# Altium project Morpheus_pill_bqle.PrjPcb
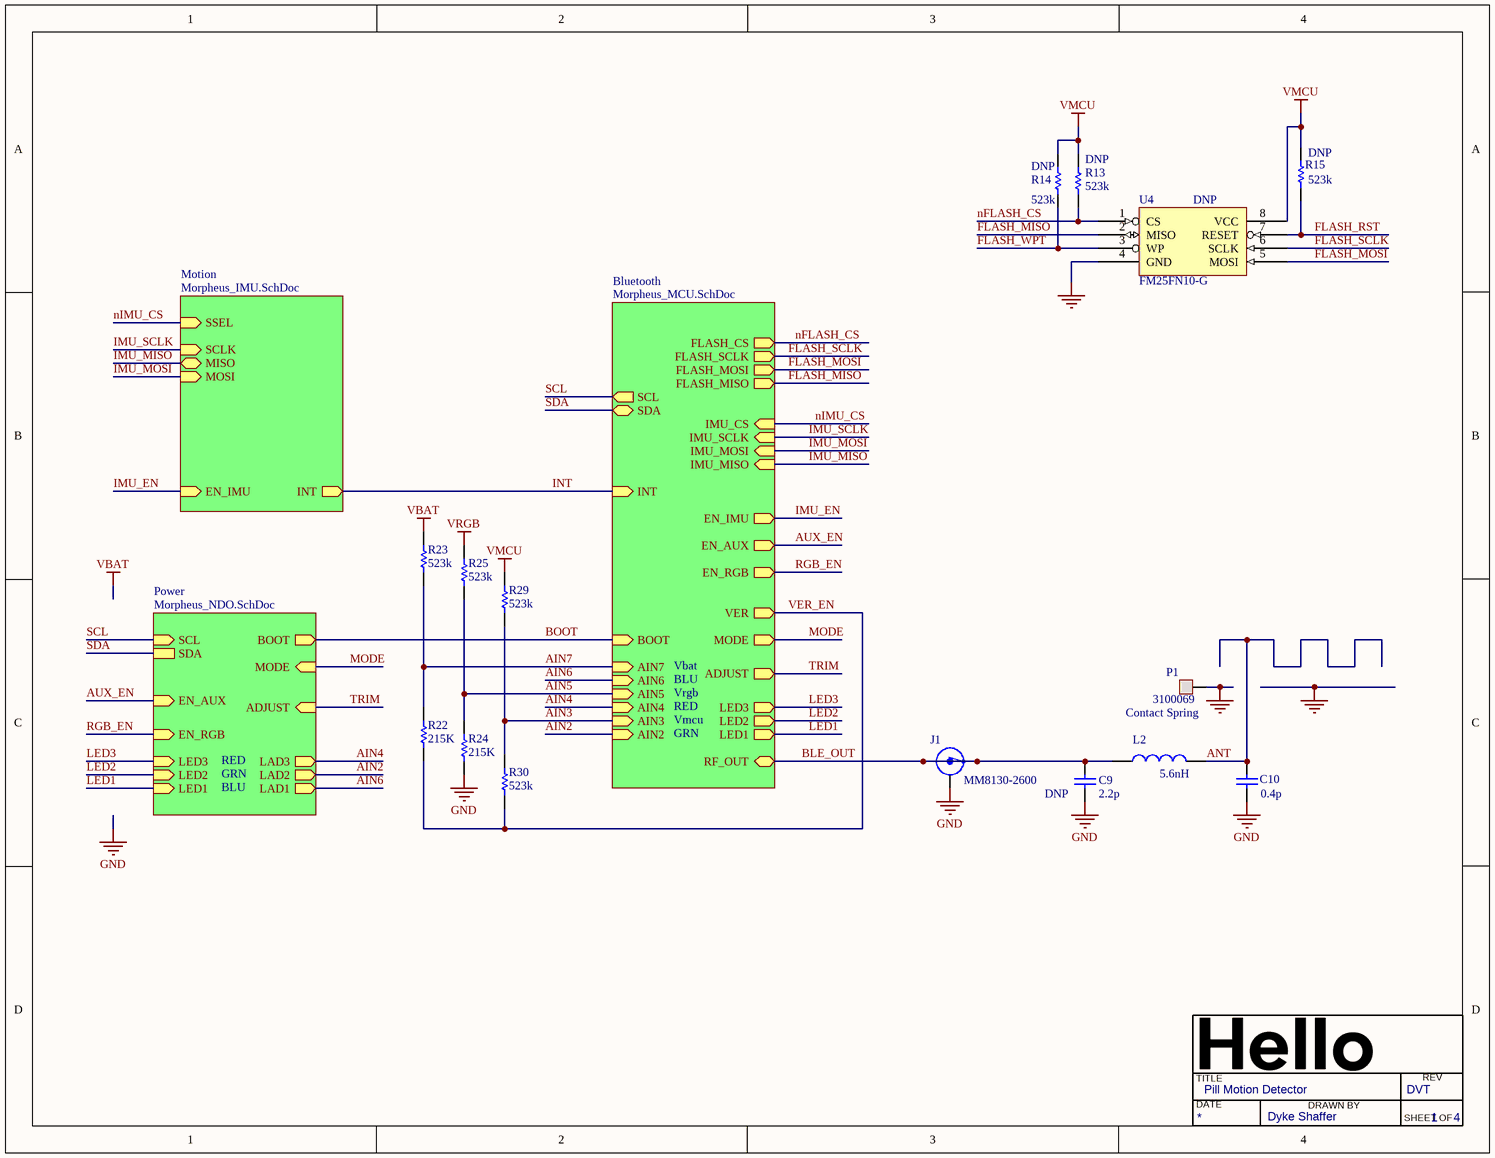
[diagram p0: Morpheus_pill_bqle.SchDoc]
4 sheets, 116 parts. Net scope: hierarchical (ports join the sheet entries above them; power ports are global).
Board files: Morpheus_pill_bqle.PcbDoc, morpheus_pill_bqle_ASSY.PcbDoc
Sheets:
  Morpheus_pill_bqle.SchDoc
    Bluetooth = Morpheus_MCU.SchDoc
    Motion = Morpheus_IMU.SchDoc
    Power = Morpheus_NDO.SchDoc

## Sheet Morpheus_pill_bqle.SchDoc: Pill Motion Detector
size Letter; DrawnBy: Dyke Shaffer; Organization: Hello Inc.; Revision: DVT; SheetNumber: 1; SheetTotal: 4

### Parts
C9  DNP  value 2.2p  [CAP0402_SENSE_DVT]
C10  value 0.4p  [CAP0402_SENSE_DVT]
J1  MM8130-2600  [COAXIAL-SWF]
L2  value 5.6nH  [IND_0402]
P1  Contact Spring  PN: 3100069  [TP120X70SC]
R13  DNP  value 523k  [RES0402_SENSE_DVT]
R14  DNP  value 523k  [RES0402_SENSE_DVT]
R15  DNP  value 523k  [RES0402_SENSE_DVT]
R22  215K  [RES0402_SENSE_DVT]
R23  523k  [RES0402_SENSE_DVT]
R24  215K  [RES0402_SENSE_DVT]
R25  523k  [RES0402_SENSE_DVT]
R29  523k  [RES0402_SENSE_DVT]
R30  523k  [RES0402_SENSE_DVT]
U4  DNP  PN: FM25FN10-G  [DFN127P600x500x80-8E]

### Sub-sheets
Bluetooth = Morpheus_MCU.SchDoc: FLASH_SCLK (out), FLASH_CS (out), INT (in), LED3 (out), EN_IMU (out), AIN6 (in), BOOT (in), SCL (out), SDA, AIN7 (in), EN_AUX (out), AIN4 (in), AIN5 (in), AIN2 (in), AIN3 (in), RF_OUT, ADJUST (out), LED2 (out), LED1 (out), EN_RGB (out), VER (out), IMU_MISO (in), IMU_SCLK (in), IMU_MOSI (in), IMU_CS (in), FLASH_MOSI (out), FLASH_MISO (out), MODE (out)
Motion = Morpheus_IMU.SchDoc: MOSI (in), MISO, SCLK (in), INT (out), SSEL (in), EN_IMU (in)
Power = Morpheus_NDO.SchDoc: SDA, BOOT (out), SCL (in), LAD3 (out), LAD2 (out), LAD1 (out), EN_AUX (in), EN_RGB (in), ADJUST (in), LED3 (in), LED2 (in), LED1 (in), MODE (in)

### Nets
GND: C9.2 C10.2 J1.2(Shield) P1.1 R24.1 U4.4(GND)
VBAT: R23.2
VMCU: R13.2 R14.2 R15.2 R29.2 U4.8(VCC)
VRGB: R25.2
AIN2: sheet Bluetooth/AIN2, sheet Power/LAD2
AIN3: R29.1 R30.2 ; sheet Bluetooth/AIN3
AIN4: sheet Bluetooth/AIN4, sheet Power/LAD3
AIN5: R24.2 R25.1 ; sheet Bluetooth/AIN5
AIN6: sheet Bluetooth/AIN6, sheet Power/LAD1
AIN7: R22.2 R23.1 ; sheet Bluetooth/AIN7
ANT: C10.1 L2.2
AUX_EN: sheet Bluetooth/EN_AUX, sheet Power/EN_AUX
BLE_OUT: C9.1 J1.1(IN) J1.3(OUT) L2.1 ; sheet Bluetooth/RF_OUT
BOOT: sheet Bluetooth/BOOT, sheet Power/BOOT
FLASH_MISO: U4.2(MISO) ; sheet Bluetooth/FLASH_MISO
FLASH_MOSI: U4.5(MOSI) ; sheet Bluetooth/FLASH_MOSI
FLASH_RST: R15.1 U4.7(RESET)
FLASH_SCLK: U4.6(SCLK) ; sheet Bluetooth/FLASH_SCLK
FLASH_WPT: R14.1 U4.3(WP)
IMU_EN: sheet Bluetooth/EN_IMU, sheet Motion/EN_IMU
IMU_MISO: sheet Bluetooth/IMU_MISO, sheet Motion/MISO
IMU_MOSI: sheet Bluetooth/IMU_MOSI, sheet Motion/MOSI
IMU_SCLK: sheet Bluetooth/IMU_SCLK, sheet Motion/SCLK
INT: sheet Bluetooth/INT, sheet Motion/INT
LED1: sheet Bluetooth/LED1, sheet Power/LED1
LED2: sheet Bluetooth/LED2, sheet Power/LED2
LED3: sheet Bluetooth/LED3, sheet Power/LED3
MODE: sheet Bluetooth/MODE, sheet Power/MODE
nFLASH_CS: R13.1 U4.1(CS) ; sheet Bluetooth/FLASH_CS
nIMU_CS: sheet Bluetooth/IMU_CS, sheet Motion/SSEL
RGB_EN: sheet Bluetooth/EN_RGB, sheet Power/EN_RGB
SCL: sheet Bluetooth/SCL, sheet Power/SCL
SDA: sheet Bluetooth/SDA, sheet Power/SDA
TRIM: sheet Bluetooth/ADJUST, sheet Power/ADJUST
VER_EN: R22.1 R30.1 ; sheet Bluetooth/VER

### Notes on the sheet
- BLU
- Vbat
- Vrgb
- GRN
- RED
- Vmcu
- TITLE
- DATE
- DRAWN BY
- REV
- SHEET
- OF

### Library data of the parts
C9 = C_2.2p_5_50_NPO_0402: Chip capacitor; Vendor: Murata; PN: GRM1555C1H2R20BA01D; Tolerance: 5 %; Voltage: 50 V; Temp: NPO; Size: 0402
C10 = C_0.4p_5_50_NPO_0402: Chip capacitor; Vendor: Murata; PN: GRM1555C1Hr40BA01D; Tolerance: 5 %; Voltage: 50 V; Temp: NPO; Size: 0402
J1 = MM8130-2600: Coaxial Connector with Switch; Manufacturer: Murata; 2nd source part number: 81-MM8130-2600RA2; Artikkelnr Noca: 55029011; Artikkelnr Simpro: N.A.; Part Number: MM8130-2600; Manufacturer Part Number: MM8130-2600; Datasheet: http://www.murata.com/products/catalog/pdf/o33e.pdf; LatestRevisionDate: 2014-04-24; Pin Count: 3; Publisher: Nordic Semiconductor; Published: 2014-04-24; Value: MM8130-2600; Note: *; Supplier: Digi-Key; Supplier part number: 490-4981-1-ND; 2nd source Supplier: Mouser; Footprint Doc: COAXIAL-SWF
L2 = L_5.6n_0.1_?_270_300_?: SMD RF inductor 2.2nH; PN: L-07C5N6SV6T; Vendor: Johanson; Tolerance: 0.1; RDC: 270; I_max: 300mA; Q: ?; I_sat: ?
P1 = TP-120X70-SC: Test Pad 120x70 mil ( contact spring ); Vendor: TE Connectivity
R13-R15 R23 R25 R29 R30 = R_523k_1_0.1_0402: Chip Resistor; Vendor: Panasonic; Tolerance: 1 %; Power: 0.1 W; PN: ERJ-2RKF5233X; Model: *; Size: 0402
  R23 R25 R29 R30: Value: 523k
R22 R24 = R_215K_1_0.1_0402: Chip Resistor; Vendor: Panasonic; Tolerance: 1 %; Power: 0.1 W; PN: ERJ-2RKF2153X; Model: *; Value: 215K; Size: 0402
U4 = FM25VN10-G: Cypress SPI FRAM 128Kx8; Vendor: Fujitsu; Value: FRAM

## Sheet Morpheus_MCU.SchDoc: Bluetooth Low Energy MCU
size Letter; Author: Dyke Shaffer; CompanyName: Hello, Inc.; Engineer: Dyke Shaffer; Organization: Hello, Inc.; Revision: DVT; SheetNumber: 4; SheetTotal: 4
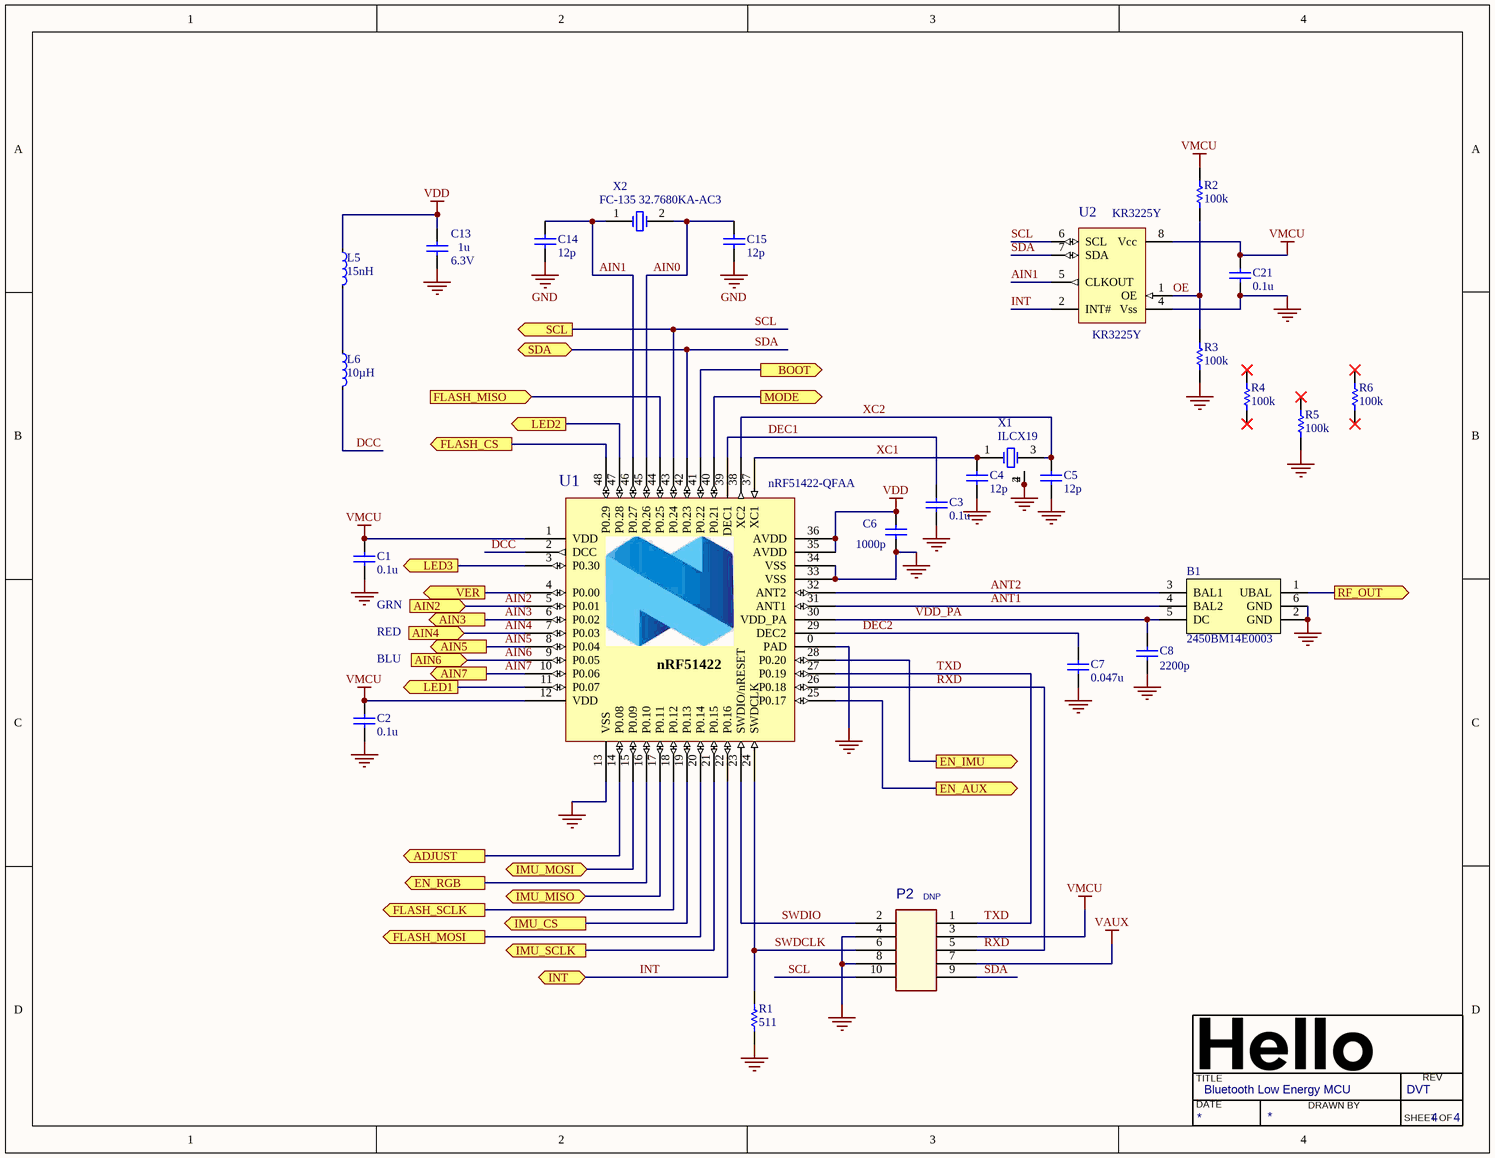
[diagram p1: Morpheus_MCU.SchDoc]

### Parts
B1  2450BM14E0003  [DFN50P160X80X70-6N]
C1  0.1u  [CAP0402_SENSE_DVT]
C2  0.1u  [CAP0402_SENSE_DVT]
C3  0.1u  [CAP0402_SENSE_DVT]
C4  12p  [CAP0402_SENSE_DVT]
C5  12p  [CAP0402_SENSE_DVT]
C6  1000p  [CAP0402_SENSE_DVT]
C7  value 0.047u  [CAP0402_SENSE_DVT]  (hidden comment: C_0.047u_10_16_X5R_0201)
C8  2200p  [CAP0402_SENSE_DVT]
C13  1u  Voltage: 6.3V  [CAP0402_SENSE_DVT]
C14  12p  [CAP0402_SENSE_DVT]
C15  12p  [CAP0402_SENSE_DVT]
C21  0.1u  [CAP0402_SENSE_DVT]
L5  15nH  [INDC1005X04L]
L6  10µH  [INDC1608X06L]
P2  DNP  [HDR1.27-2X5-N]
R1  511  [RES0402_SENSE_DVT]
R2  100k  [RES0402_SENSE_DVT]
R3  100k  [RES0402_SENSE_DVT]
R4  100k  [RES0402_SENSE_DVT]
R5  100k  [RES0402_SENSE_DVT]
R6  100k  [RES0402_SENSE_DVT]
U1  nRF51422-QFAA  [VQFN40P600X600X100-48]
U2  KR3225Y  [8-CLCC-KYOCERO]
X1  ILCX19  [ILCX19]
X2  FC-135 32.7680KA-AC3  [Epson_FC-135]

### Ports
ADJUST (out), AIN2 (in), AIN3 (out), AIN4 (in), AIN5 (out), AIN6 (in), AIN7 (out), BOOT (out), EN_AUX (out), EN_IMU (out), EN_RGB (out), FLASH_CS (out), FLASH_MISO (in), FLASH_MOSI (out), FLASH_SCLK (out), IMU_CS (out), IMU_MISO, IMU_MOSI, IMU_SCLK (out), INT (bidir), LED1 (out), LED2 (out), LED3 (out), MODE (out), RF_OUT (out), SCL (out), SDA, VER (out)

### Nets
GND: B1.2(GND) B1.6(GND) C1.1 C2.1 C3.1 C4.1 C5.1 C6.1 C7.1 C8.1 C13.1 C14.1 C15.1 C21.1 P2.4 P2.8 R1.1 R3.1 R5.1 U1.0(PAD) U1.13(VSS) U1.33(VSS) U1.34(VSS) U2.4(NC) X1.2(GND1) X1.4(XTAL2)
VAUX: P2.7
VDD: C6.2 C13.2 L5.1 U1.35(AVDD) U1.36(AVDD)
VMCU: C1.2 C2.2 C21.2 P2.3 R2.2 U1.1(VDD) U1.12(VDD) U2.8(Vcc)
AIN0: C15.2 U1.45(P0.26) X2.2
AIN1: C14.2 U1.46(P0.27) U2.5(CLKOUT) X2.1
AIN2: U1.5(P0.01) ; port AIN2
AIN3: U1.6(P0.02) ; port AIN3
AIN4: U1.7(P0.03) ; port AIN4
AIN5: U1.8(P0.04) ; port AIN5
AIN6: U1.9(P0.05) ; port AIN6
AIN7: U1.10(P0.06) ; port AIN7
ANT1: B1.4(BAL2) U1.31(ANT1)
ANT2: B1.3(BAL1) U1.32(ANT2)
AUX_EN: U1.25(P0.17) ; port EN_AUX
BLE_OUT: B1.1(UBAL) ; port RF_OUT
BOOT: U1.41(P0.22) ; port BOOT
DCC: L6.2 U1.2(DCC)
DEC1: C3.2 U1.39(DEC1)
DEC2: C7.2 U1.29(DEC2)
FLASH_MISO: U1.44(P0.25) ; port FLASH_MISO
FLASH_MOSI: U1.20(P0.14) ; port FLASH_MOSI
FLASH_SCLK: U1.18(P0.12) ; port FLASH_SCLK
IMU_EN: U1.28(P0.20) ; port EN_IMU
IMU_MISO: U1.17(P0.11) ; port IMU_MISO
IMU_MOSI: U1.15(P0.09) ; port IMU_MOSI
IMU_SCLK: U1.21(P0.15) ; port IMU_SCLK
INT: U1.22(P0.16) U2.2(INT#) ; port INT
LED1: U1.11(P0.07) ; port LED1
LED2: U1.47(P0.28) ; port LED2
LED3: U1.3(P0.30) ; port LED3
MODE: U1.40(P0.21) ; port MODE
nFLASH_CS: U1.48(P0.29) ; port FLASH_CS
nIMU_CS: U1.19(P0.13) ; port IMU_CS
OE: R2.1 R3.2 U2.1(OE)
RGB_EN: U1.16(P0.10) ; port EN_RGB
RXD: P2.5 U1.26(P0.18)
SCL: P2.10 U1.43(P0.24) U2.6(SCL) ; port SCL
SDA: P2.9 U1.42(P0.23) U2.7(NC) ; port SDA
SWDCLK: P2.6 R1.2 U1.24(SWDCLK)
SWDIO: P2.2 U1.23(SWDIO/nRESET)
TRIM: U1.14(P0.08) ; port ADJUST
TXD: P2.1 U1.27(P0.19)
VDD_PA: B1.5(DC) C8.2 U1.30(VDD_PA)
VER_EN: U1.4(P0.00) ; port VER
XC1: C4.2 U1.37(XC1) X1.1(XTAL1)
XC2: C5.2 U1.38(XC2) X1.3(XTAL2)
NetL5_2: L5.2 L6.1

Not connected (* = marked no-connect by the designer): R4 1* 2*; R5 2*; R6 1* 2*

### Notes on the sheet
- (near C1) GRN
- RED
- (near C2) BLU
- TITLE
- DATE
- DRAWN BY
- REV
- SHEET
- OF
- (in symbol nRF51422_QFAA) nRF51422

### Library data of the parts
B1 = 2450BM14E0003: 2.45 GHz Impedance Matched Balun-Filter; Vendor: Johanson; PN: 2450BM14E0003
C1-C3 C21 = C_0.1u_10_50_X7R_0402: Chip capacitor; Vendor: Taiyo Yuden; PN: UMK105B7104KV-FR; Tolerance: 10%; Voltage: 50V; Temp: X7R; Value: 0.1u; Size: 0402
C4 C5 C14 C15 = C_12p_5_50_C0G_0402: Chip capacitor; Vendor: Murata; PN: GRM1555C1H120JA01D; Tolerance: 5%; Voltage: 50V; Temp: C0G; Value: 12p; Size: 0402
C6 = C_1000p_10_25_X7R_0201: Chip capacitor; Vendor: Taiyo Yuden; PN: TMK063B7102KP-F; Tolerance: 10%; Voltage: 25V; Temp: X7R; Value: 1000p; Size: 0201
C7 = C_0.047u_10_16_X5R_0201: Chip capacitor; Vendor: Murata; PN: GRM033R61C473KE84D; Tolerance: 10%; Voltage: 16V; Temp: X5R; Size: 0201
C8 = C_2200p_5_16_X7R_0201: Chip capacitor; Vendor: Murata; PN: GRM033R71C222KA88D; Tolerance: 5 %; Voltage: 16V; Type: X7R; Value: 2200p; Size: 0201
C13 = C_1u_10_6.3_X5R_0402: Chip capacitor; Vendor: Taiyo Yuden; PN: JMK105BJ105KV-F; Tolerance: 10%; Temp: X5R; Value: 1u; Size: 0402
L5 = L0402-15n: Inductor, 320mA, ±5%; Manufacturer: Taiyo Yuden; Manufacturer Part Number: HK100515NJ-T; 2nd source part number: 658-1328; Note: High frequency chip inductor ±10%; Artikkelnr Noca: 33029323; Artikkelnr Simpro: N.A.; Part Number: L0402-15n; LatestRevisionDate: 2012-09-19; Pin Count: 2; Publisher: Nordic Semiconductor; Published: 2010-07-12; Value: 15nH; Supplier: Digi-Key; Datasheet: http://www.yuden.co.jp/productdata/catalog/en/mlci04_e.pdf; Supplier part number: 587-1521-1-ND; 2nd source Supplier: Farnell; Footprint Doc: 0402
L6 = L0603-10µ: Inductor, 80mA, ±10%; Manufacturer: Taiyo Yuden; Manufacturer Part Number: LBMF1608T100K; 2nd source part number: 178-6105; Note: LBMF1608T100K 10µH 80mA 0603; Artikkelnr Noca: 33029314; Artikkelnr Simpro: N.A.; Part Number: L0603-10µ; Datasheet: http://www.yuden.co.jp/ut/product/pdf/elb2_e.pdf; LatestRevisionDate: 2012-09-19; Pin Count: 2; Publisher: Nordic Semiconductor; Published: 2010-02-24; Value: 10µH; Supplier: Digi-Key; Supplier part number: 587-1714-1-ND; 2nd source Supplier: Farnell; Footprint Doc: 0603
P2 = CON10A: part_name: CONN HDR 1.27MM VERT AU 12 POS; manufacturer information: Harwin, Inc.; suggested vendor p/n: M50-3500642; distributor p/n: 952-1384-ND; distributor: Digikey
R1 = R_511_1_0.1_0402: Chip Resistor; Vendor: Panasonic; Tolerance: 1 %; Power: 0.1 W; PN: ERJ-2RKF5110X; Model: *; Value: 511; Size: 0402
R2-R6 = R_100k_1_0.1_0402: Chip Resistor; Vendor: Panasonic; Tolerance: 1 %; Power: 0.1 W; PN: ERJ-2RKF1003X; Model: *; Value: 100k; Size: 0402
U1 = nRF51422_QFAA: Multi-protocol Bluetooth Low Energy, ANT and 2.4GHz proprietary system-on-chip; Vendor: Nordic Semiconductor; PN: nRF51422-QFAA
U2 = KR3225Y32768DGR: Kyocero I2C RTC w/ Crystal; PN: KR3225Y
X1 = ILCX19: ILSI ILCX19 Crystal Oscillator; PN: ILCX19
X2 = Espon_FC-135 32.7680KA-AC3: Epson 32kHz crystal, 9pF; PN: FC-135 32.7680KA-AC3; Vendor: Epson

## Sheet Morpheus_IMU.SchDoc: IMU Motion Detecter
size Letter; CompanyName: Hello Inc.; Organization: Hello Inc.; Revision: DVT; SheetNumber: 3; SheetTotal: 4
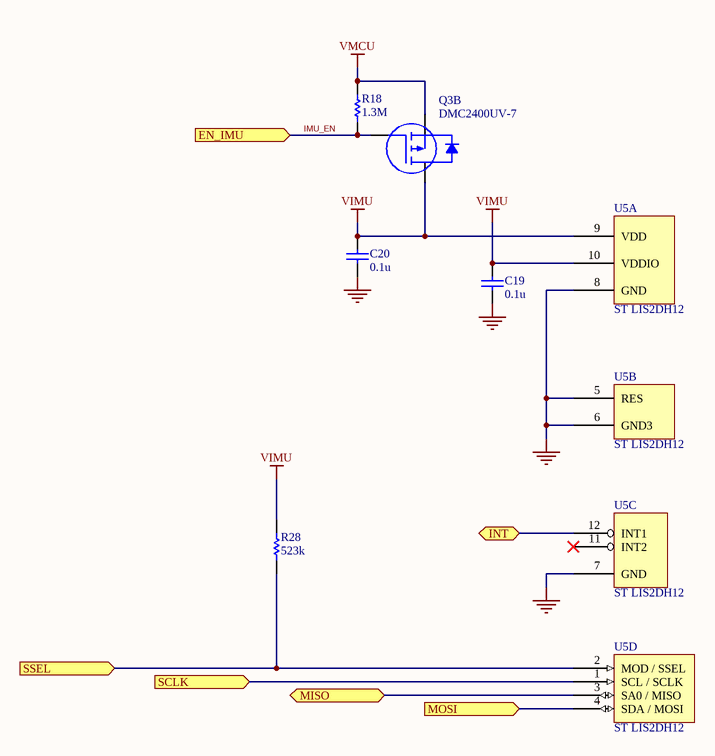
[diagram p2: Morpheus_IMU.SchDoc]

### Parts
C19  0.1u  [CAP0402_SENSE_DVT]
C20  0.1u  [CAP0402_SENSE_DVT]
Q3  DMC2400UV-7  [SOT-563]  (part B of 2)
R18  1.3M  [RES0402_SENSE_DVT]
R28  523k  [RES0402_SENSE_DVT]
U5  ST LIS2DH12  [DFN50P200X200X80-12N]  (parts A,B,C,D of 4)

### Ports
EN_IMU (in), INT (bidir), MISO, MOSI (in), SCLK (in), SSEL (in)

### Nets
GND: C19.1 C20.1 U5.5(RES) U5.6(GND3) U5.7(GND) U5.8(GND)
VIMU: C19.2 C20.2 Q3.3(D2) R28.2 U5.9(VDD) U5.10(VDDIO)
VMCU: Q3.4(S2) R18.2
IMU_EN: Q3.5(G2) R18.1 ; port EN_IMU
IMU_MISO: U5.3(SA0_/_MISO) ; port MISO
IMU_MOSI: U5.4(SDA_/_MOSI) ; port MOSI
IMU_SCLK: U5.1(SCL_/_SCLK) ; port SCLK
INT: U5.12(INT1) ; port INT
nIMU_CS: R28.1 U5.2(MOD_/_SSEL) ; port SSEL

Not connected (* = marked no-connect by the designer): U5 11(INT2)*

### Notes on the sheet
- TITLE
- DATE
- DRAWN BY
- REV
- SHEET
- OF

### Library data of the parts
C19 C20 = C_0.1u_10_50_X7R_0402: as C1 on sheet Morpheus_MCU; Value: 0.1u; Size: 0402
Q3 = DMC2400UV-7: Dual PN-Channel MOSFET 1.2v drive 20V 0.88A; Vendor: Diodes Inc; PN: DMC2400UV-7
R18 = R_1.3M_5_0.1_0402: Chip Resistor; Vendor: Panasonic; Tolerance: 5 %; Power: 0.1 W; PN: ERJ-2GEJ135X; Model: *; Value: 1.3M; Size: 0402
R28 = R_523k_1_0.1_0402: as R13 on sheet Morpheus_pill_bqle; Model: *; Value: 523k; Size: 0402
U5 = LIS2DH12: STU Accelerometer; PN: LIS2DH12

## Sheet Morpheus_NDO.SchDoc: LDO with Boost Converter
size Letter; CompanyName: Hello Inc.; DrawnBy: Dyke Shaffer; Organization: Hello Inc.; Revision: DVT; SheetNumber: 2; SheetTotal: 4
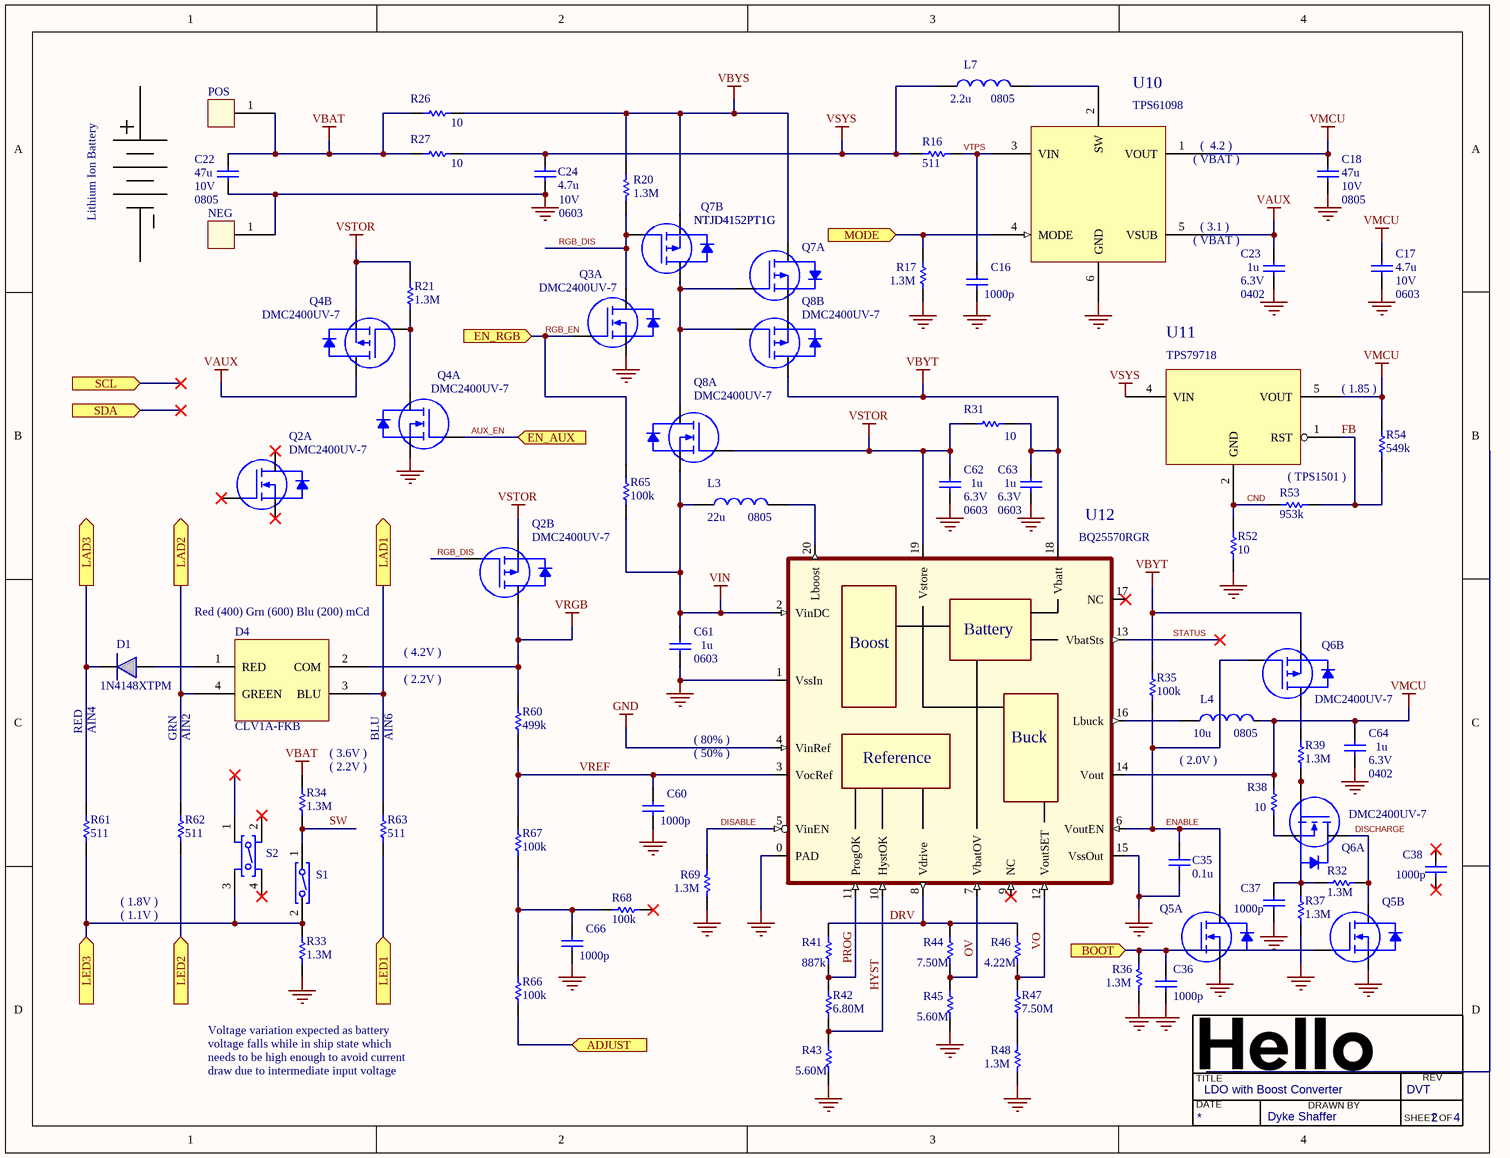
[diagram p3: Morpheus_NDO.SchDoc]

### Parts
C16  1000p  [0402C20X24]
C17  4.7u  Size: 0603  Voltage: 10V  [CAP0603_SENSE_DVT]
C18  47u  Size: 0805  Voltage: 10V  [0805C45X55]
C22  47u  Size: 0805  Voltage: 10V  [0805C45X55]
C23  1u  Size: 0402  Voltage: 6.3V  [CAP0402_SENSE_DVT]
C24  4.7u  Size: 0603  Voltage: 10V  [CAP0603_SENSE_DVT]
C35  0.1u  [CAP0402_SENSE_DVT]
C36  1000p  [0402C20X24]
C37  1000p  [0402C20X24]
C38  1000p  [0402C20X24]
C60  1000p  [0402C20X24]
C61  1u  Size: 0603  [CAP0603_SENSE_DVT]
C62  1u  Size: 0603  Voltage: 6.3V  [CAP0603_SENSE_DVT]
C63  1u  Size: 0603  Voltage: 6.3V  [CAP0603_SENSE_DVT]
C64  1u  Size: 0402  Voltage: 6.3V  [CAP0402_SENSE_DVT]
C66  1000p  [0402C20X24]
D1  1N4148XTPM  [SOD523]
D4  value Red (400) Grn (600) Blu (200) mCd  [PLCC150X290P280X320X190-4]  (hidden comment: CLV1A-FKB)
L3  22u  Size: 0805  [IND_0805]
L4  10u  Size: 0805  [IND_0805]
L7  2.2u  Size: 0805  [IND_0805]
NEG  (no value)  [TP80x50CP]
POS  (no value)  [TP80x50CP]
Q2  DMC2400UV-7  [SOT-563]  (parts A,B of 2)
Q3  DMC2400UV-7  [SOT-563]  (part A of 2)
Q4  DMC2400UV-7  [SOT-563]  (parts A,B of 2)
Q5  DMG6301UDW-7  [SOT-563]  (value not drawn)  (parts A,B of 2)
Q6  DMC2400UV-7  [SOT-563]  (parts A,B of 2)
Q7  NTJD4152PT1G  [SOT-563]  (parts A,B of 2)
Q8  DMC2400UV-7  [SOT-563]  (parts A,B of 2)
R16  511  [RES0402_SENSE_DVT]
R17  1.3M  [RES0402_SENSE_DVT]
R20  1.3M  [RES0402_SENSE_DVT]
R21  1.3M  [RES0402_SENSE_DVT]
R26  10  [RES0402_SENSE_DVT]
R27  10  [RES0402_SENSE_DVT]
R31  10  [RES0402_SENSE_DVT]
R32  1.3M  [RES0402_SENSE_DVT]
R33  1.3M  [RES0402_SENSE_DVT]
R34  1.3M  [RES0402_SENSE_DVT]
R35  100k  [RES0402_SENSE_DVT]
R36  1.3M  [RES0402_SENSE_DVT]
R37  1.3M  [RES0402_SENSE_DVT]
R38  10  [RES0402_SENSE_DVT]
R39  1.3M  [RES0402_SENSE_DVT]
R41  887k  [0402R18X20]
R42  6.80M  [0402R18X20]
R43  5.60M  [0402R18X20]
R44  7.50M  [0402R18X20]
R45  5.60M  [0402R18X20]
R46  4.22M  [0402R18X20]
R47  7.50M  [0402R18X20]
R48  1.3M  [0402R18X20]
R52  10  [RES0402_SENSE_DVT]
R53  953k  [RES0402_SENSE_DVT]
R54  value 549k  [RES0402_SENSE_DVT]
R60  499k  [RES0402_SENSE_DVT]
R61  511  [RES0402_SENSE_DVT]
R62  511  [RES0402_SENSE_DVT]
R63  511  [RES0402_SENSE_DVT]
R65  100k  [RES0402_SENSE_DVT]
R66  100k  [RES0402_SENSE_DVT]
R67  100k  [RES0402_SENSE_DVT]
R68  100k  [RES0402_SENSE_DVT]
R69  1.3M  [0402R18X20]
S1  REED_SPST_NO  [REED-10x1.8]  (value not drawn)
S2  REED_SPST_NO  [PLCC350X400P450X450X65-4]  (value not drawn)
U10  TPS61098  [DFN50P150X150X80-6N]
U11  TPS79718  [SOT65P212X110-5N]
U12  BQ25570RGR  [VQFN50P350X350X100-20]

### Ports
ADJUST (in), BOOT (in), EN_AUX (in), EN_RGB (in), LAD1 (out), LAD2 (out), LAD3 (out), LED1 (in), LED2 (in), LED3 (in), MODE (in), SCL (in), SDA (in)

### Nets
GND: C16.1 C17.1 C18.1 C22.1 C23.1 C24.1 C35.1 C36.1 C37.1 C60.1 C61.1 C62.1 C63.1 C64.1 C66.1 NEG.1 Q3.1(S1) Q4.1(S1) Q5.1(S1) Q5.4(S2) R17.2 R33.1 R36.1 R37.1 R43.1 R45.1 R48.1 R52.1 R69.1 U10.6(GND) U12.0(PAD) U12.1(VssIn) U12.4(VinRef) U12.15(VssOut)
VAUX: C23.2 Q4.3(D2) U10.5(VSUB)
VBAT: C22.2 POS.1 R26.1 R27.1 R34.2
VBYS: Q7.4(S2) Q7.6(D1) R20.2 R26.2
VBYT: C63.2 Q6.4(S2) Q8.3(D2) R31.1 R35.2 U12.18(Vbatt)
VIN: C61.2 L3.2 Q8.1(S1) R65.1 U12.2(VinDC)
VMCU: C17.2 C18.2 C64.2 L4.1 R38.2 R54.2 U10.1(VOUT) U11.5(VOUT) U12.14(Vout)
VRGB: D4.2(COM) Q2.3(D2) R60.2
VSTOR: C62.2 Q2.4(S2) Q4.4(S2) Q8.2(G1) R21.2 R31.2 U12.19(Vstore)
VSYS: C24.2 L7.2 R16.2 R27.2 U11.4(VIN)
AIN2: D4.4(GREEN) R62.2 ; port LAD2
AIN4: D1.1(Cathode) R61.2 ; port LAD3
AIN6: D4.3(BLU) R63.2 ; port LAD1
AUX_EN: Q4.2(G1) ; port EN_AUX
BOOT: C36.2 Q5.2(G1) Q5.5(G2) R36.2 ; port BOOT
CND: R52.2 R53.1 U11.2(GND)
DISABLE: R69.2 U12.5(VinEN)
DISCHARGE: Q5.3(D2) Q6.6(D1) R32.1
DRV: R41.2 R44.2 R46.2 U12.8(Vdrive)
ENABLE: C35.2 Q5.6(D1) Q6.5(G2) R35.1 U12.6(VoutEN)
FB: R53.2 R54.1 U11.1(RST)
HYST: R42.1 R43.2 U12.10(HystOK)
LED1: R63.1 ; port LED1
LED2: R62.1 ; port LED2
LED3: R33.2 R61.1 S1.2 S2.3 ; port LED3
MODE: R17.1 U10.4(MODE) ; port MODE
OV: R44.1 R45.2 U12.7(VbatOV)
PROG: R41.1 R42.2 U12.11(ProgOK)
RGB_DIS: Q2.5(G2) Q3.6(D1) Q7.5(G2) R20.1
RGB_EN: Q3.2(G1) R65.2 ; port EN_RGB
STATUS: U12.13(VbatSts)
SW: R34.1 S1.1
TRIM: R66.1 ; port ADJUST
VO: R46.1 R47.2 U12.12(VoutSET)
VREF: C60.2 R60.1 R67.2 U12.3(VocRef)
VTPS: C16.2 R16.1 U10.3(VIN)
NetC37_2: C37.2 Q6.2(G1) R32.2 R37.2 R39.1
NetC66_2: C66.2 R66.2 R67.1 R68.2
NetD1_2: D1.2(Anode) D4.1(RED)
NetL3_1: L3.1 U12.20(Lboost)
NetL4_2: L4.2 U12.16(Lbuck)
NetL7_1: L7.1 U10.2(SW)
NetQ4_5: Q4.5(G2) Q4.6(D1) R21.1
NetQ6_1: Q6.1(S1) R38.1
NetQ6_3: Q6.3(D2) R39.2
NetQ7_1: Q7.1(S1) Q8.4(S2)
NetQ7_2: Q7.2(G1) Q7.3(D2) Q8.5(G2) Q8.6(D1)
NetR47_1: R47.1 R48.2

Not connected (* = marked no-connect by the designer): C38 1* 2*; Q2 1(S1)* 2(G1)* 6(D1)*; R68 1*; S2 1* 2* 4*; U12 9(NC)* 17(NC)*

### Notes on the sheet
- (near U10) ( VBAT )
- (near U10) (  4.2 )
- Lithium Ion Battery
- ( 3.1 )
- ( VBAT )
- ( 1.85 )
- (near U11) ( TPS1501 )
- ( 2.2V )
- ( 4.2V )
- RED
- (near D1) AIN4
- GRN
- AIN2
- ( 3.6V )
- BLU
- AIN6
- ( 80% )
- ( 50% )
- ( 2.0V )
- ( 1.8V )
- ( 1.1V )
- Voltage variation expected as battery
- voltage falls while in ship state which
- needs to be high enough to avoid current
- draw due to intermediate input voltage
- TITLE
- DATE
- DRAWN BY
- REV
- SHEET
- OF
- (in symbol BQ25570RGR) Battery; Boost; Buck; Reference

### Library data of the parts
C16 C36-C38 C60 C66 = C_1000p_10_50_X7R_0402: Chip capacitor; Vendor: Murata; PN: GRM155R71H102KA01D; Tolerance: 10%; Voltage: 50V; Temp: X7R; Value: 1000p; Size: 0402
C17 C24 = C_4.7u_20_10_X5R_0603: Chip capacitor; Vendor: TDK; PN: CGB3B1X5R1A475M055AC; Tolerance: 20%; Temp: X5R; Value: 4.7u
C18 C22 = C_47u_20_10_X5R_0805: Chip capacitor; Vendor: TDK; PN: C2012X5R1A476M125AC; Tolerance: 20%; Temp: X5R; Value: 47u
C23 C62-C64 = C_1u_10_6.3_X5R_0402: as C13 on sheet Morpheus_MCU; Value: 1u
C35 = C_0.1u_10_50_X7R_0402: as C1 on sheet Morpheus_MCU; Value: 0.1u; Size: 0402
C61 = C_1u_10_6.3_X5R_0402: Chip capacitor; Vendor: Taiyo Yuden; PN: JMK105BJ105KV-F; Tolerance: 10%; Voltage: 6.3V; Temp: X5R; Value: 1u
D1 = 1N4148XTPM: Silicon diode, 30V 200mA; Vendor: ON Semi; PN: 1N4148XTPM
D4 = CLV1A-FKB: RGB LED Array; Vendor: CREE; PN: CLV1A-FKB
L3 = L_22u_0805: SMD power inductor, 22uH; Vendor: Murata; Tolerance: 20%; RDC: 0.19; I_max: 0.9; I_sat: 1.0; PN: ?; Value: 22u; Q: ?
L4 = L_10u_0805: SMD power inductor, 10uH; Vendor: Murata; Tolerance: 20%; RDC: 0.19; I_max: 0.9; I_sat: 1.0; PN: ?; Value: 10u; Q: ?
L7 = L_2.2u_0805: SMD power inductor, 2.2uH; Vendor: Murata; Tolerance: 20%; RDC: 0.19; I_max: 0.9; I_sat: 1.0; PN: ?; Value: 2.2u; Q: ?
NEG POS = 5016: Single-pad test point
Q2-Q4 Q6 Q8 = DMC2400UV-7: as Q3 on sheet Morpheus_IMU; PN: DMC2400UV-7
Q5 = DMG6301UDW-7: Vendor: Diodes Inc.; PN: DMG6301UDW-7
Q7 = NTJD4152PT1G: Dual P-Channel MOSFET 1.2v drive 20V 0.88A; Vendor: ON Semi; PN: NTJD4152PT1G
R16 R61-R63 = R_511_1_0.1_0402: as R1 on sheet Morpheus_MCU; Model: *; Value: 511; Size: 0402
R17 R20 R21 R32-R34 R36 R37 R39 R48 R69 = R_1.3M_5_0.1_0402: as R18 on sheet Morpheus_IMU; Model: *; Value: 1.3M; Size: 0402
R26 R27 R31 R38 R52 = R_10_1_0.1_0402: Chip Resistor; Vendor: Panasonic; Tolerance: 1 %; Power: 0.1 W; PN: ERJ-2RKF10R0X; Model: *; Value: 10; Size: 0402
R35 R65-R68 = R_100k_1_0.1_0402: as R2 on sheet Morpheus_MCU; Model: *; Value: 100k; Size: 0402
R41 = R_887k_1_0.1_0402: Chip Resistor; Vendor: Panasonic; Tolerance: 1 %; Power: 0.1 W; PN: ERJ-2RKF8873X; Model: *; Value: 887k; Size: 0402
R42 = R_6.80M_1_0.1_0402: Chip Resistor; Vendor: Vishay Dale; Tolerance: 1 %; Power: 0.1 W; PN: CRCW04026M80JNED; Model: *; Value: 6.80M; Size: 0402
R43 R45 = R_5.60M_1_0.1_0402: Chip Resistor; Vendor: Vishay Dale; Tolerance: 1 %; Power: 0.1 W; PN: CRCW04025M60JNED; Model: *; Value: 5.60M; Size: 0402
R44 R47 = R_7.50M_1_0.1_0402: Chip Resistor; Vendor: Vishay Dale; Tolerance: 1 %; Power: 0.1 W; PN: CRCW04027M50JNED; Model: *; Value: 7.50M; Size: 0402
R46 = R_4.22M_1_0.1_0402: Chip Resistor; Vendor: Vishay Dale; Tolerance: 1 %; Power: 0.1 W; PN: CRCW04024M22FKED; Model: *; Value: 4.22M; Size: 0402
R53 = R_953k_1_0.1_0402: Chip Resistor; Vendor: Panasonic; Tolerance: 1 %; Power: 0.1 W; PN: ERJ-2RKF9533X; Model: *; Value: 953k; Size: 0402
R54 = R_549k_1_0.1_0402: Chip Resistor; Vendor: Panasonic; Tolerance: 1 %; Power: 0.1 W; PN: ERJ-2RKF5493X; Model: *; Size: 0402
R60 = R_499k_1_0.1_0402: Chip Resistor; Vendor: Panasonic; Tolerance: 1 %; Power: 0.1 W; PN: ERJ-2RKF4993X; Model: *; Value: 499k; Size: 0402
S1 = SW_REED_SPST_NO: SWITCH REED SPST NO; PN: ORD213-1015; Vendor: ORD
S2 = SW_SPST_NO: SWITCH SPST NO; PN: <button switch>; Vendor: <push button>
U10 = TPS61098: Boost Converter
U11 = TPS79718DCK: LDO 1.8V SC70-5; PN: TPS79718DCKT

## Nets that join several sheets
GND: Morpheus_pill_bqle (6 pins), Morpheus_MCU (26 pins), Morpheus_IMU (6 pins), Morpheus_NDO (34 pins)
VAUX: Morpheus_MCU (P2.7), Morpheus_NDO (C23.2 Q4.3 U10.5)
VBAT: Morpheus_pill_bqle (R23.2), Morpheus_NDO (5 pins)
VMCU: Morpheus_pill_bqle (5 pins), Morpheus_MCU (8 pins), Morpheus_IMU (Q3.4 R18.2), Morpheus_NDO (9 pins)
VRGB: Morpheus_pill_bqle (R25.2), Morpheus_NDO (D4.2 Q2.3 R60.2)
AIN2: Morpheus_MCU (U1.5), Morpheus_NDO (D4.4 R62.2)
AIN3: Morpheus_pill_bqle (R29.1 R30.2), Morpheus_MCU (U1.6)
AIN4: Morpheus_MCU (U1.7), Morpheus_NDO (D1.1 R61.2)
AIN5: Morpheus_pill_bqle (R24.2 R25.1), Morpheus_MCU (U1.8)
AIN6: Morpheus_MCU (U1.9), Morpheus_NDO (D4.3 R63.2)
AIN7: Morpheus_pill_bqle (R22.2 R23.1), Morpheus_MCU (U1.10)
AUX_EN: Morpheus_MCU (U1.25), Morpheus_NDO (Q4.2)
BLE_OUT: Morpheus_pill_bqle (C9.1 J1.1 J1.3 L2.1), Morpheus_MCU (B1.1)
BOOT: Morpheus_MCU (U1.41), Morpheus_NDO (C36.2 Q5.2 Q5.5 R36.2)
FLASH_MISO: Morpheus_pill_bqle (U4.2), Morpheus_MCU (U1.44)
FLASH_MOSI: Morpheus_pill_bqle (U4.5), Morpheus_MCU (U1.20)
FLASH_SCLK: Morpheus_pill_bqle (U4.6), Morpheus_MCU (U1.18)
IMU_EN: Morpheus_MCU (U1.28), Morpheus_IMU (Q3.5 R18.1)
IMU_MISO: Morpheus_MCU (U1.17), Morpheus_IMU (U5.3)
IMU_MOSI: Morpheus_MCU (U1.15), Morpheus_IMU (U5.4)
IMU_SCLK: Morpheus_MCU (U1.21), Morpheus_IMU (U5.1)
INT: Morpheus_MCU (U1.22 U2.2), Morpheus_IMU (U5.12)
LED1: Morpheus_MCU (U1.11), Morpheus_NDO (R63.1)
LED2: Morpheus_MCU (U1.47), Morpheus_NDO (R62.1)
LED3: Morpheus_MCU (U1.3), Morpheus_NDO (R33.2 R61.1 S1.2 S2.3)
MODE: Morpheus_MCU (U1.40), Morpheus_NDO (R17.1 U10.4)
nFLASH_CS: Morpheus_pill_bqle (R13.1 U4.1), Morpheus_MCU (U1.48)
nIMU_CS: Morpheus_MCU (U1.19), Morpheus_IMU (R28.1 U5.2)
RGB_EN: Morpheus_MCU (U1.16), Morpheus_NDO (Q3.2 R65.2)
TRIM: Morpheus_MCU (U1.14), Morpheus_NDO (R66.1)
VER_EN: Morpheus_pill_bqle (R22.1 R30.1), Morpheus_MCU (U1.4)